# Altium project Gastroscopy-Controller.PrjPcb (part 1 of 2)
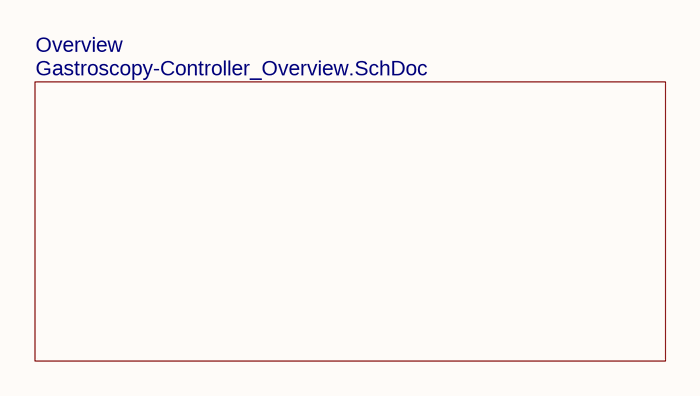
[diagram p0: Gastroscopy-Controller_Title.SchDoc]
GlobalAddress1: nab. reki Karpovki, d. 5/3E; GlobalAddress2: Saint-Petersburg, 197022; GlobalAddress3: Ph: +7 (911) 701-51-99; GlobalCompanyName: MRobot, LCC; GlobalDocumentNumberDrawingASM: 0000-0000; GlobalDocumentNumberDrawingPCB: 0000-0000; GlobalDocumentNumberPCB: 0000-0000; GlobalDocumentNumberSCH: 0000-0000; GlobalDocumentSubtitle: Gastroscopy Controller; GlobalDocumentTitle: Gastroscopy Controller; GlobalEngineer: Podlesnyi Vasilii; GlobalJiraKey: GSTRCNTRL; GlobalProjectTitle: Gastroscopy Controller; GlobalRevisionBOM: 0.1.0; GlobalRevisionPCB: 0.1.0; GlobalRevisionSCH: 0.1.0
7 sheets, 141 parts. Net scope: hierarchical (ports join the sheet entries above them; power ports are global).
Board file: Gastroscopy-Controller.PcbDoc
Sheets:
  Gastroscopy-Controller_Title.SchDoc
    Overview = Gastroscopy-Controller_Overview.SchDoc
      MCU = Gastroscopy-Controller_MCU.SchDoc
      USB = Gastroscopy-Controller_USB.SchDoc
      Buttons1 = Gastroscopy-Controller_Button.SchDoc
      Buttons2 = Gastroscopy-Controller_Button.SchDoc
      Buttons3 = Gastroscopy-Controller_Button.SchDoc
      Buttons4 = Gastroscopy-Controller_Button.SchDoc
      Buttons5 = Gastroscopy-Controller_Button.SchDoc
      Buttons6 = Gastroscopy-Controller_Button.SchDoc
      Relays1 = Gastroscopy-Controller_Relay.SchDoc
      Relays2 = Gastroscopy-Controller_Relay.SchDoc
      LED Driver = Gastroscopy-Controller_LED.SchDoc

## Sheet Gastroscopy-Controller_Title.SchDoc: not used
size 215 x 279 mm; PageSetup: Record=PageOptions|CenterHorizontal=True|CenterVertical=True|PrintScale=0.94|XCorrection=1.00|YCorrection=1.00|PrintKind=0|BorderSize=5000000|LeftOffset=0|BottomOffset=0|Orientation=2|PaperLength=1000|PaperWidth=1000|Scale=100|PaperSource=15|PrintQuality=600|MediaType=1|DitherType=10|PrintScaleMode=1|PaperKind=Letter|PaperIndex=1; VersionControl_RevNumber: not used; IsUserConfigurable: not used; Date: not used; ApprovedBy: not used; CheckedBy: not used; Author: not used; CompanyName: MRobot, LCC; DrawnBy: not used; Engineer: not used; Organization: not used; Address1: not used; Address2: not used; Address3: not used; Address4: not used; DocumentNumber: 0000-0000; Revision: not used; SheetNumber: 1; SheetTotal: 9; DocumentTitle: Gastroscopy Controller; DocumentSubtitle: Gastroscopy Controller; ProjectTitle: Gastroscopy Controller; JiraKey: GSTRCNTRL; Time: not used; ImagePath: not used; Application_BuildNumber: not used

### Sub-sheets
Overview = Gastroscopy-Controller_Overview.SchDoc: no entries

### Notes on the sheet
- Company:
- Project:
- Jira Key:

## Sheet Gastroscopy-Controller_Overview.SchDoc: Overview
size 279 x 215 mm; Date: not used; ApprovedBy: not used; CheckedBy: not used; Author: not used; CompanyName: MRobot, LCC; DrawnBy: not used; Engineer: Podlesnyi Vasilii; Organization: not used; Address1: nab. reki Karpovki, d. 5/3E; Address2: Saint-Petersburg, 197022; Address3: Ph: +7 (911) 701-51-99; Address4: not used; DocumentNumber: 0000-0000; Revision: 0.1.0; SheetNumber: 2; SheetTotal: 8; ProjectTitle: Gastroscopy Controller; Time: not used; ImagePath: not used; Application_BuildNumber: not used
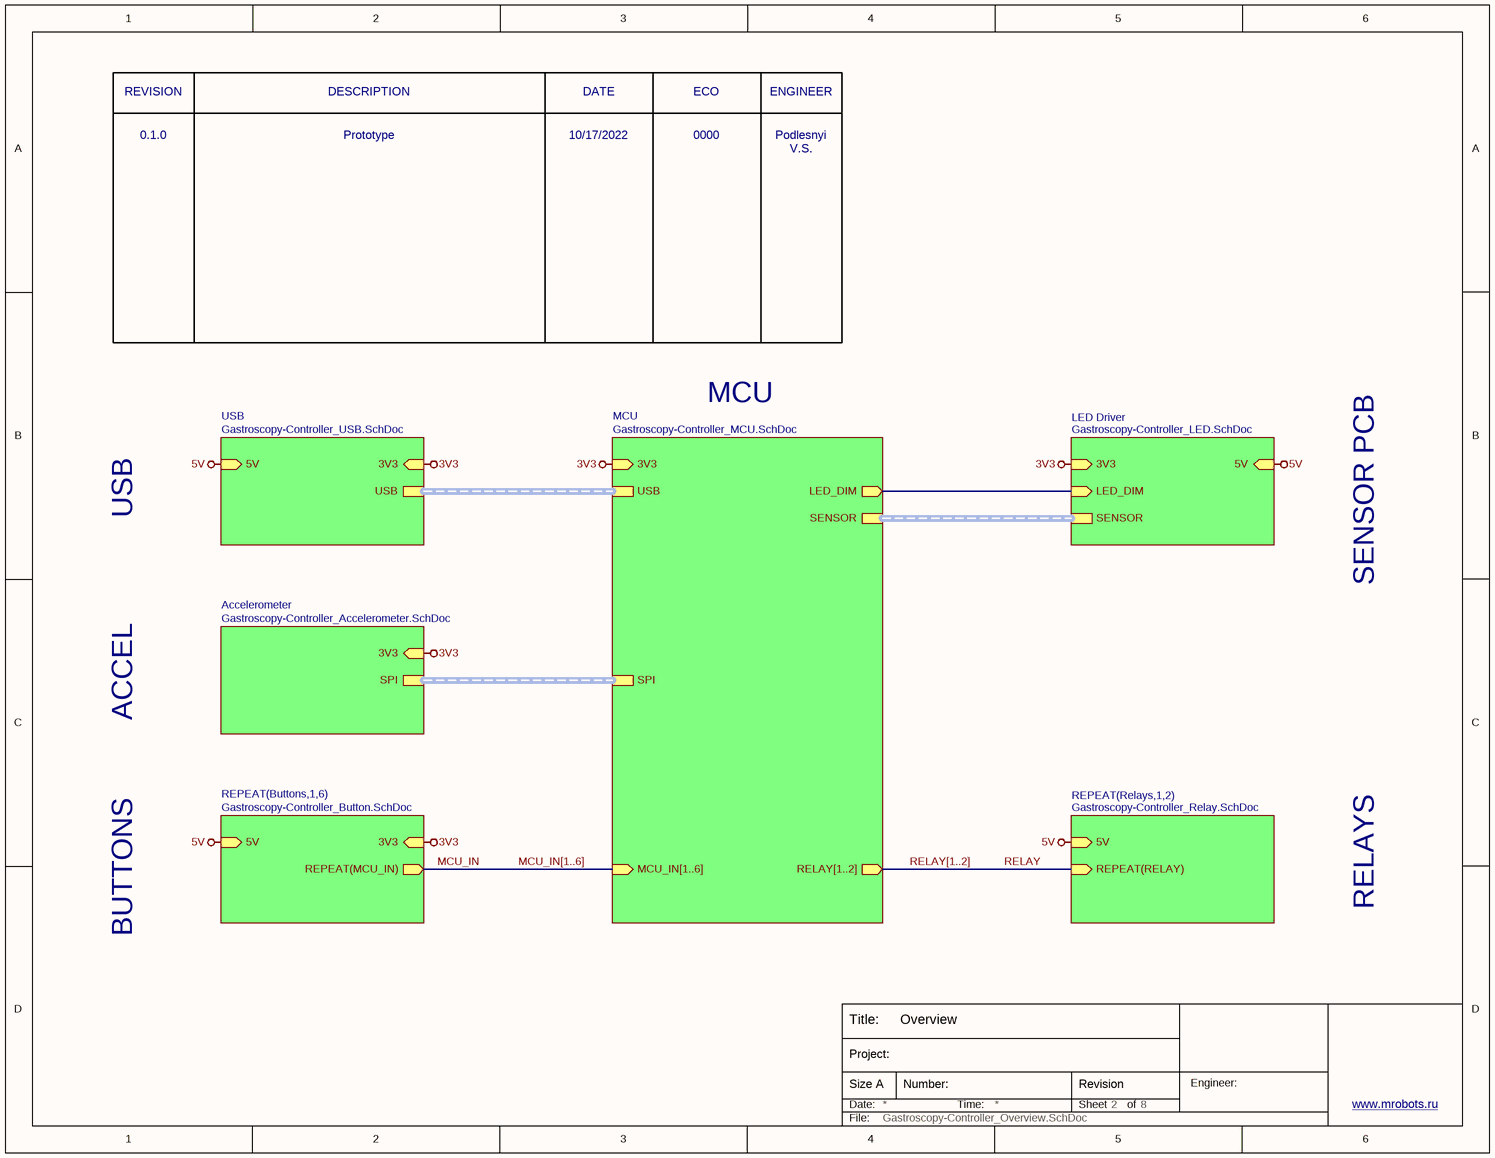
[diagram p1: Gastroscopy-Controller_Overview.SchDoc]

### Sub-sheets
Accelerometer = Gastroscopy-Controller_Accelerometer.SchDoc (file not in this document): 3V3 (in), SPI (harness SPI)
LED Driver = Gastroscopy-Controller_LED.SchDoc: 5V (in), LED_DIM (in), SENSOR (harness SENSOR), 3V3 (in)
MCU = Gastroscopy-Controller_MCU.SchDoc: 3V3 (in), SPI (harness SPI), USB (harness USB), MCU_IN[1..6] (in), RELAY[1..2] (out), SENSOR (harness SENSOR), LED_DIM (out)
REPEAT(Buttons,1,6) = Gastroscopy-Controller_Button.SchDoc: 3V3 (in), 5V (in), REPEAT(MCU_IN) (out)
REPEAT(Relays,1,2) = Gastroscopy-Controller_Relay.SchDoc: 5V (in), REPEAT(RELAY) (in)
USB = Gastroscopy-Controller_USB.SchDoc: 3V3 (in), USB (harness USB), 5V (in)

### Nets
3V3: sheet MCU/3V3, sheet USB/3V3, sheet Accelerometer/3V3, sheet REPEAT(Buttons,1,6)/3V3, sheet LED Driver/3V3
5V: sheet USB/5V, sheet REPEAT(Buttons,1,6)/5V, sheet REPEAT(Relays,1,2)/5V, sheet LED Driver/5V
LED_DIM: sheet MCU/LED_DIM, sheet LED Driver/LED_DIM
MCU_IN: sheet REPEAT(Buttons,1,6)/REPEAT(MCU_IN)
RELAY: sheet REPEAT(Relays,1,2)/REPEAT(RELAY)

### Buses and harness runs
bus MCU_IN[1..6] = sheet MCU/MCU_IN[1..6]
bus RELAY[1..2] = sheet MCU/RELAY[1..2]
harness sheet Accelerometer/SPI = sheet MCU/SPI
harness sheet LED Driver/SENSOR = sheet MCU/SENSOR
harness sheet MCU/USB = sheet USB/USB

### Notes on the sheet
- REVISION
- DESCRIPTION
- DATE
- ECO
- ENGINEER
- 0.1.0
- Prototype
- 10/17/2022
- 0000
- Podlesnyi V.S.
- MCU
- USB
- SENSOR PCB
- ACCEL
- RELAYS
- BUTTONS
- Title:
- Date:
- Size A
- Project:
- Number:
- Time:
- Sheet
- Revision
- of
- Engineer:
- www.mrobots.ru <http://mrobots.ru/>
- File:

## Sheet Gastroscopy-Controller_MCU.SchDoc: MCU
size 279 x 215 mm; Date: not used; ApprovedBy: not used; CheckedBy: not used; Author: not used; CompanyName: MRobot, LCC; DrawnBy: not used; Engineer: Podlesnyi Vasilii; Organization: not used; Address1: nab. reki Karpovki, d. 5/3E; Address2: Saint-Petersburg, 197022; Address3: Ph: +7 (911) 701-51-99; Address4: not used; DocumentNumber: 0000-0000; Revision: 0.1.0; SheetNumber: 4; SheetTotal: 8; ProjectTitle: Gastroscopy Controller; Time: not used; ImagePath: not used; Application_BuildNumber: not used
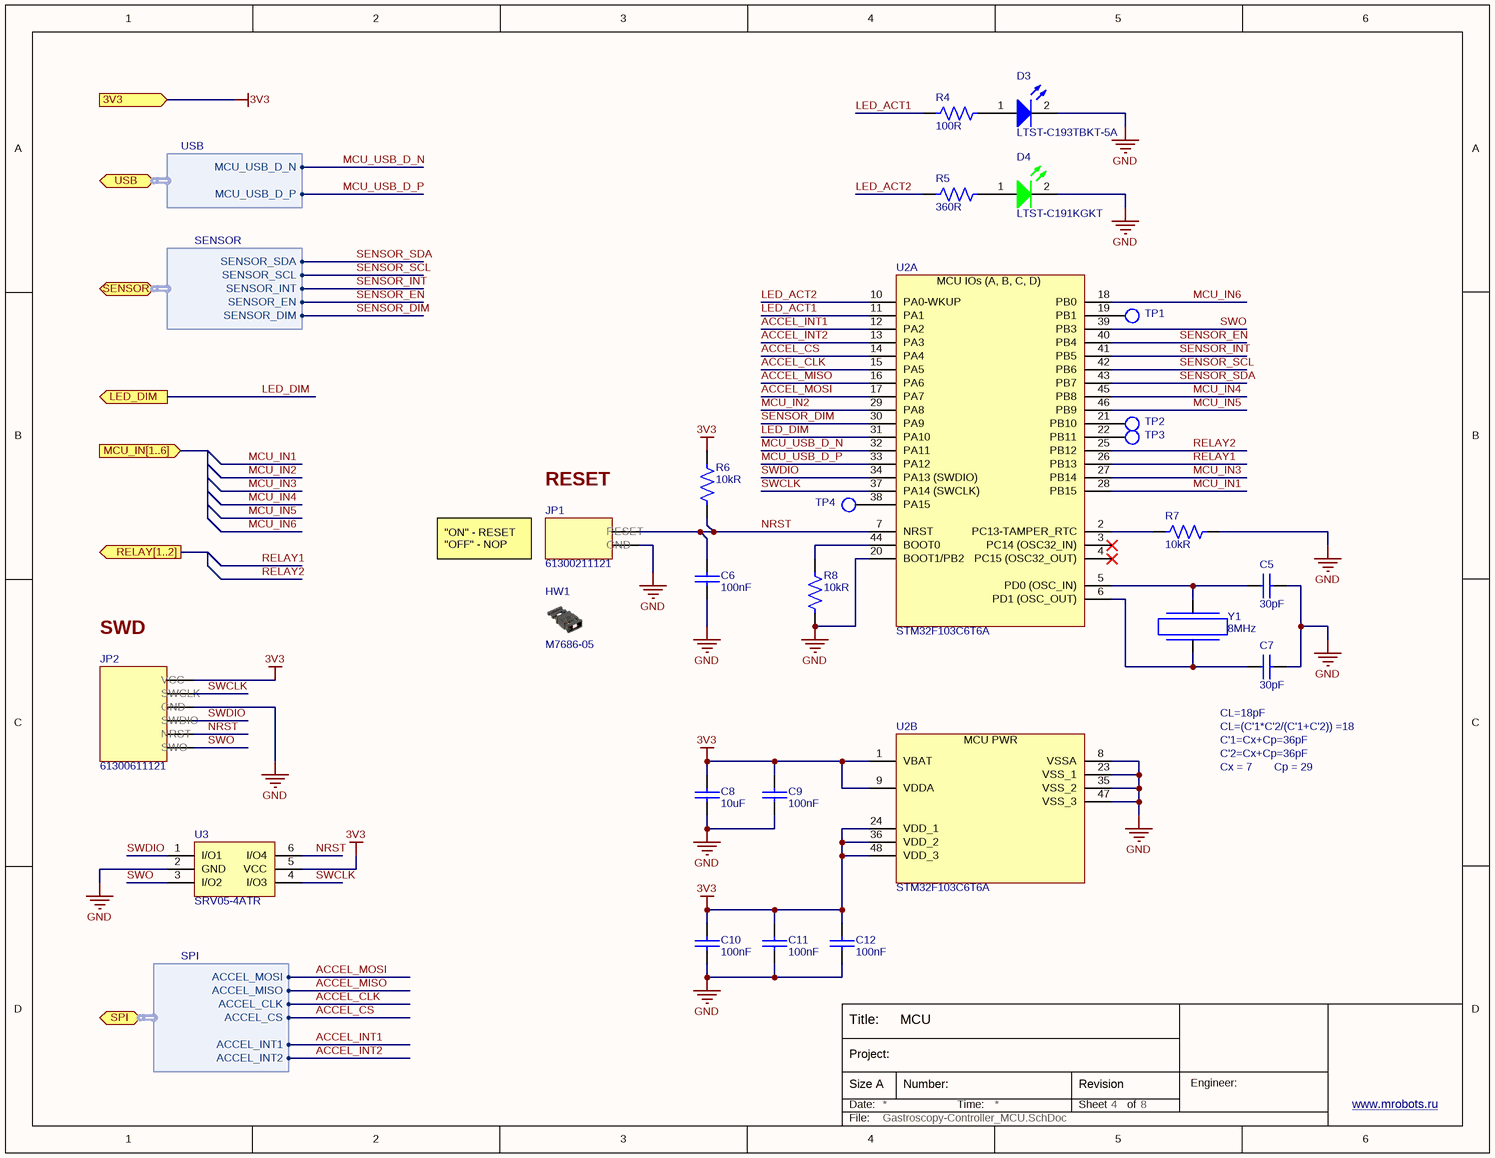
[diagram p2: Gastroscopy-Controller_MCU.SchDoc]

### Parts
C5  30pF  [CAP_0603]
C6  100nF  [CAP_0603]
C7  30pF  [CAP_0603]
C8  10uF  [CAP_0805]
C9  100nF  [CAP_0603]
C10  100nF  [CAP_0603]
C11  100nF  [CAP_0603]
C12  100nF  [CAP_0603]
D3  LTST-C193TBKT-5A  [L_0603_BLUE]
D4  LTST-C191KGKT  [L_0603_GREEN]
HW1  M7686-05  (mechanical)
JP1  61300211121  [PLS-2]
JP2  61300611121  [PLS-6]
R4  100R  [RES_0603]
R5  360R  [RES_0603]
R6  10kR  [RES_0603]
R7  10kR  [RES_0603]
R8  10kR  [RES_0603]
TP1  TEST_POINT_SMT  [TEST_POINT_SMT]  (value not drawn)  (no BOM)
TP2  TEST_POINT_SMT  [TEST_POINT_SMT]  (value not drawn)  (no BOM)
TP3  TEST_POINT_SMT  [TEST_POINT_SMT]  (value not drawn)  (no BOM)
TP4  TEST_POINT_SMT  [TEST_POINT_SMT]  (value not drawn)  (no BOM)
U2  STM32F103C6T6A  [LQFP48]  (parts A,B of 2)
U3  SRV05-4ATR  [SOT-23-6]
Y1  8MHz  [HC-49/US]

### Ports
3V3 (in), LED_DIM (out), MCU_IN[1..6] (in), RELAY[1..2] (out), SENSOR (bidir, harness SENSOR), SPI (bidir, harness SPI), USB (bidir, harness USB)

### Harnesses
USB: MCU_USB_D_N, MCU_USB_D_P
SENSOR: SENSOR_SDA, SENSOR_SCL, SENSOR_INT, SENSOR_EN, SENSOR_DIM
SPI: ACCEL_MOSI, ACCEL_MISO, ACCEL_CLK, ACCEL_INT1, ACCEL_CS, ACCEL_INT2

### Nets
3V3: C8.2 C9.1 C10.1 C11.1 C12.1 JP2.1 R6.1 U2.1(VBAT) U2.9(VDDA) U2.24(VDD_1) U2.36(VDD_2) U2.48(VDD_3) U3.5(VCC) ; port 3V3
GND: C5.2 C6.2 C7.2 C8.1 C9.2 C10.2 C11.2 C12.2 D3.2(K) D4.2(K) JP1.2 JP2.3 R7.1 R8.1 U2.8(VSSA) U2.20(BOOT1/PB2) U2.23(VSS_1) U2.35(VSS_2) U2.47(VSS_3) U3.2(GND)
ACCEL_CLK: U2.15(PA5) ; port SPI.ACCEL_CLK
ACCEL_CS: U2.14(PA4) ; port SPI.ACCEL_CS
ACCEL_INT1: U2.12(PA2) ; port SPI.ACCEL_INT1
ACCEL_INT2: U2.13(PA3) ; port SPI.ACCEL_INT2
ACCEL_MISO: U2.16(PA6) ; port SPI.ACCEL_MISO
ACCEL_MOSI: U2.17(PA7) ; port SPI.ACCEL_MOSI
LED_ACT1: R4.1 U2.11(PA1)
LED_ACT2: R5.1 U2.10(PA0-WKUP)
LED_DIM: U2.31(PA10) ; port LED_DIM
MCU_IN1: U2.28(PB15)
MCU_IN2: U2.29(PA8)
MCU_IN3: U2.27(PB14)
MCU_IN4: U2.45(PB8)
MCU_IN5: U2.46(PB9)
MCU_IN6: U2.18(PB0)
MCU_USB_D_N: U2.32(PA11) ; port USB.MCU_USB_D_N
MCU_USB_D_P: U2.33(PA12) ; port USB.MCU_USB_D_P
NRST: C6.1 JP1.1 JP2.5 R6.2 U2.7(NRST) U3.6(I/O4)
RELAY1: U2.26(PB13)
RELAY2: U2.25(PB12)
SENSOR_DIM: U2.30(PA9) ; port SENSOR.SENSOR_DIM
SENSOR_EN: U2.40(PB4) ; port SENSOR.SENSOR_EN
SENSOR_INT: U2.41(PB5) ; port SENSOR.SENSOR_INT
SENSOR_SCL: U2.42(PB6) ; port SENSOR.SENSOR_SCL
SENSOR_SDA: U2.43(PB7) ; port SENSOR.SENSOR_SDA
SWCLK: JP2.2 U2.37(PA14_(SWCLK)) U3.4(I/O3)
SWDIO: JP2.4 U2.34(PA13_(SWDIO)) U3.1(I/O1)
SWO: JP2.6 U2.39(PB3) U3.3(I/O2)
NetC5_1: C5.1 U2.5(PD0_(OSC_IN)) Y1.2
NetC7_1: C7.1 U2.6(PD1_(OSC_OUT)) Y1.1
NetD3_1: D3.1(A) R4.2
NetD4_1: D4.1(A) R5.2
NetR7_2: R7.2 U2.2(PC13-TAMPER_RTC)
NetR8_2: R8.2 U2.44(BOOT0)
NetTP1_1: TP1.1 U2.19(PB1)
NetTP2_1: TP2.1 U2.21(PB10)
NetTP3_1: TP3.1 U2.22(PB11)
NetTP4_1: TP4.1 U2.38(PA15)

Not connected (* = marked no-connect by the designer): U2 3(PC14_(OSC32_IN))* 4(PC15_(OSC32_OUT))*

### Notes on the sheet
- (near JP1) RESET
- (near HW1) "ON" - RESET
  "OFF" - NOP
- SWD
- (near C7) CL=18pF
- CL=(C'1*C'2/(C'1+C'2)) =18
- Cx = 7
- C'1=Cx+Cp=36pF
- C'2=Cx+Cp=36pF
- Cp = 29
- Title:
- Date:
- Size A
- Project:
- Number:
- Time:
- Sheet
- Revision
- of
- Engineer:
- www.mrobots.ru <http://mrobots.ru/>
- File:
- (in symbol STM32F103C6T6A, part A) MCU IOs (A, B, C, D)
- (in symbol STM32F103C6T6A, part B) MCU PWR

### Library data of the parts
C5 C7 = CC0603JRNPO9BN300: CAP CER 30PF 50V NPO 0603; Manufacturer: Yageo; Tolerance: 5%; Dielectric: C0G; Dissipation Factor: 0.1%; Insulation Resistance: 10GR; Supplier 1: Arrow Electronics; Manufacturer Part Number: CC0603JRNPO9BN300; RoHS: Yes; Category: Ceramic Capacitors; Stock 1: 24000; Pricing 1: 4000=0,01130, 8000=0,00940, 12000=0,00820, 40000=0,00780 (USD); Mount: Surface Mount; Case/Package: 0603; Number of Pins: 2; Case Code (Imperial): 0603; Case Code (Metric): 1608; Weight: 7.1E-05oz; Min Operating Temperature: -55°C; Max Operating Temperature: 125°C; Capacitance: 30pF; Voltage Rating: 50V; Packaging: Tape and Reel; Voltage Rating (DC): 50V; Termination: SMD/SMT; Resistor Type: Ceramic; Series: CC; Construction: Flat; Length: 1.6mm; Width: 0.8mm; Height: 0.8mm; Thickness: 0.035inch; Depth: 0.8mm; Radiation Hardening: No; Reach SVHC Compliant: Yes; Lead Free: Lead Free; RoHS Compliant: Yes; ComponentLink1URL: https://datasheet.ciiva.com/26862/getdatasheetpartid-403531-26862766.pdf?src-supplier=Verical; ComponentLink1Description: https://datasheet.ciiva.com/26862/getdatasheetpartid-403531-26862766.pdf?src-supplier=Verical; ComponentLink2URL: https://datasheet.ciiva.com/7978/1132289-7978140.pdf?src-supplier=Element14; ComponentLink2Description: https://datasheet.ciiva.com/7978/1132289-7978140.pdf?src-supplier=Element14; ComponentLink3URL: https://datasheet.ciiva.com/28450/1443161-28450494.pdf?src-supplier=Element14; ComponentLink3Description: https://datasheet.ciiva.com/28450/1443161-28450494.pdf?src-supplier=Element14; ComponentLink4URL: https://datasheet.ciiva.com/13264/upy-gp-np0-16v-to-50v-8-3714-13264406.pdf?src-supplier=Mouser; ComponentLink4Description: https://datasheet.ciiva.com/13264/upy-gp-np0-16v-to-50v-8-3714-13264406.pdf?src-supplier=Mouser; Supplier Part Number 1: CC0603JRNPO9BN300
C6 C9-C12 = CL10B104KB8NNNL: CAP CER 0.1UF 50V X7R 0603; Manufacturer 1: Samsung; Tolerance: 10%; Supplier 1: Digi-Key; Manufacturer Part Number 1: CL10B104KB8NNNL; RoHS: Yes; Category: Ceramic Capacitors; Stock 1: 2348404; Pricing 1: 15000=0,00532, 30000=0,00506 (USD); Mount: Surface Mount; Case/Package: 0603; Min Operating Temperature: -55°C; Max Operating Temperature: 125°C; Capacitance: 100nF; Packaging: Tape and Reel; Package Quantity: 15000; Voltage Rating: 50V; Dielectric: X7R; Voltage Rating (DC): 50V; Series: CL; Construction: Flat; Length: 1.6mm; Width: 0.031inch; Height: 0.8mm; Thickness: 0.035inch; Depth: 0.8mm; Radiation Hardening: No; RoHS Compliant: Yes; ComponentLink1URL: https://datasheet.ciiva.com/26838/getdatasheetpartid-357523-26838415.pdf?src-supplier=Verical; ComponentLink1Description: https://datasheet.ciiva.com/26838/getdatasheetpartid-357523-26838415.pdf?src-supplier=Verical; ComponentLink2URL: https://datasheet.ciiva.com/25741/cl10b104kb8nnnl-25741341.pdf?src-supplier=Digi-Key; ComponentLink2Description: https://datasheet.ciiva.com/25741/cl10b104kb8nnnl-25741341.pdf?src-supplier=Digi-Key; Supplier Part Number 1: 1276-CL10B104KB8NNNLTR-ND
C8 = CL21B106KOQNNNE: CAP CER 10UF 16V X7R 0805; Manufacturer 1: Samsung; Tolerance: 10%; Supplier 1: Avnet; Manufacturer Part Number 1: CL21B106KOQNNNE; RoHS: Yes; Category: Ceramic Capacitors; Stock 1: 1089000; Pricing 1: 2000=0,02892, 4000=0,02851, 8000=0,02768, 12000=0,02707, 16000=0,02603 (USD); Mount: Surface Mount; Case/Package: 0805; Case Code (Metric): 2012; Case Code (Imperial): 0805; Contact Plating: Tin; Min Operating Temperature: -55°C; Max Operating Temperature: 125°C; Packaging: Tape and Reel; Capacitance: 10uF; Voltage Rating: 16V; Package Quantity: 1; Dielectric: X7R; Series: CL; Construction: Flat; Voltage: 16V; Length: 2mm; Width: 0.049inch; Height: 1.25mm; Thickness: 0.055inch; Depth: 1.25mm; Radiation Hardening: No; RoHS Compliant: Yes; ComponentLink1URL: https://datasheet.ciiva.com/25794/cl21b106koqnnne-25794472.pdf?src-supplier=Digi-Key; ComponentLink1Description: https://datasheet.ciiva.com/25794/cl21b106koqnnne-25794472.pdf?src-supplier=Digi-Key; ComponentLink2URL: https://datasheet.ciiva.com/16428/cl21b106koqnnne-16428887.pdf?src-supplier=Future+Electronics; ComponentLink2Description: https://datasheet.ciiva.com/16428/cl21b106koqnnne-16428887.pdf?src-supplier=Future+Electronics; ComponentLink3URL: https://datasheet.ciiva.com/26920/getdatasheetpartid-355170-26920201.pdf?src-supplier=Verical; ComponentLink3Description: https://datasheet.ciiva.com/26920/getdatasheetpartid-355170-26920201.pdf?src-supplier=Verical; Supplier Part Number 1: CL21B106KOQNNNE
D3 = LTST-C193TBKT-5A: LED BLUE CLEAR CHIP SMD; Manufacturer 1: Vishay Lite-On; Lens Color: Colorless; Forward Current: 20mA; Forward Voltage: 2.8V; Luminous Intensity: 15mcd; Viewing Angle: 130°; Lens Style: Diffused,Colorless,Rectangular,Clear; Dominant Wavelength: 475nm; Test Current: 5mA; Number of Elements: 1; Power Dissipation: 76mW; Reverse Voltage: 5V; Supplier 1: Arrow Electronics; RoHS: Yes; Category: LEDs; Stock 1: 226; Pricing 1: 1=0.33280, 10=0.16780, 25=0.16610 (USD); Mount: Surface Mount; Case/Package: 0603; Number of Pins: 2; Color: Blue; Case Code (Metric): 1608; Case Code (Imperial): 0603; Min Operating Temperature: -20°C; Max Operating Temperature: 80°C; Illumination Color: Blue; Packaging: Tape and Reel; Package Quantity: 1; Lens Transparency: Clear; Number of LEDs: 1; Length: 1.6mm; Width: 0.8mm; Height: 0.35mm; Depth: 0.8mm; Radiation Hardening: No; RoHS Compliant: Yes; Lead Free: Lead Free; ComponentLink1URL: https://datasheet.ciiva.com/2111/ltst-c193tbkt-5a-2111219.pdf?src-supplier=Digi-Key; ComponentLink1Description: https://datasheet.ciiva.com/2111/ltst-c193tbkt-5a-2111219.pdf?src-supplier=Digi-Key; ComponentLink2URL: https://datasheet.ciiva.com/11773/0900766b80dc0554-11773880.pdf?src-supplier=RSComponents; ComponentLink2Description: https://datasheet.ciiva.com/11773/0900766b80dc0554-11773880.pdf?src-supplier=RSComponents; ComponentLink3URL: https://datasheet.ciiva.com/4688/lite-on-ltst-c193tbkt-5a-187386-4688832.pdf?src-supplier=Mouser; ComponentLink3Description: https://datasheet.ciiva.com/4688/lite-on-ltst-c193tbkt-5a-187386-4688832.pdf?src-supplier=Mouser; ComponentLink4URL: https://datasheet.ciiva.com/16210/ltst-c193tbkt-5a-16210824.pdf?src-supplier=Future+Electronics; ComponentLink4Description: https://datasheet.ciiva.com/16210/ltst-c193tbkt-5a-16210824.pdf?src-supplier=Future+Electronics; ComponentLink5URL: https://datasheet.ciiva.com/15201/getdatasheetpartid-293056-15201395.pdf?src-supplier=Verical; ComponentLink5Description: https://datasheet.ciiva.com/15201/getdatasheetpartid-293056-15201395.pdf?src-supplier=Verical; ComponentLink6URL: https://datasheet.ciiva.com/2111/p-100-ltst-c193tbkt-5a-2111220.pdf?src-supplier=Digi-Key; ComponentLink6Description: https://datasheet.ciiva.com/2111/p-100-ltst-c193tbkt-5a-2111220.pdf?src-supplier=Digi-Key; ComponentLink7URL: https://datasheet.ciiva.com/2111/p-100-ltst-c193tbkt-5a-2111221.pdf?src-supplier=Digi-Key; ComponentLink7Description: https://datasheet.ciiva.com/2111/p-100-ltst-c193tbkt-5a-2111221.pdf?src-supplier=Digi-Key; Supplier Part Number 1: LTST-C193TBKT-5A; Manufacturer Part Number 1: LTST-C193TBKT-5A
D4 = LTST-C191KGKT: LED GREEN CLEAR SMD; Manufacturer 1: Vishay Lite-On; Lens Color: Colorless; Luminous Intensity: 35mcd; Viewing Angle: 130°; Forward Voltage: 2V; Dominant Wavelength: 571nm; Test Current: 20mA; Wavelength: 574nm; Lens Style: Rectangular,Colorless; Forward Current: 30mA; Number of Elements: 1; Power Dissipation: 75mW; Reverse Voltage: 5V; Supplier 1: Arrow Electronics; RoHS: Yes; Category: LEDs; Stock 1: 10000; Pricing 1: 5000=0.04240, 10000=0.03360, 25000=0.02880, 50000=0.02750 (USD); Mount: Surface Mount; Case/Package: 0603; Number of Pins: 2; Color: Green; Case Code (Metric): 1608; Case Code (Imperial): 0603; Min Operating Temperature: -55°C; Max Operating Temperature: 85°C; Packaging: Tape and Reel; Package Quantity: 1; Lens Transparency: Clear; Illumination Color: Green; Number of LEDs: 1; Power Rating: 75mW; Max Power Dissipation: 75mW; Length: 1.6mm; Width: 0.8mm; Height: 0.55mm; Depth: 0.8mm; Radiation Hardening: No; RoHS Compliant: Yes; Lead Free: Lead Free; ComponentLink1URL: https://datasheet.ciiva.com/2109/ltst-c191kgkt-2109973.pdf?src-supplier=Digi-Key; ComponentLink1Description: https://datasheet.ciiva.com/2109/ltst-c191kgkt-2109973.pdf?src-supplier=Digi-Key; Supplier Part Number 1: LTST-C191KGKT; Manufacturer Part Number 1: LTST-C191KGKT
HW1 = M7686-05: CLOSED TOP JUMPER SOCKET; Manufacturer 1: Harwin; Plating: Gold; Number of Contacts: 2; Contact Resistance: 25mR; Current Rating: 3A; Mating Cycles: 300; Voltage Rating (AC): 250V; Gender: Receptacle; Insulation Resistance: 1GR; Pitch: 2.54mm; Body Length: 10mm; Supplier 1: Digi-Key; Manufacturer Part Number 1: M7686-05; RoHS: Yes; Category: Terminal Blocks; Stock 1: 26597; Pricing 1: 1=0,40000, 10=0,34400, 25=0,30280, 50=0,27820, 100=0,26720, 250=0,23996, 500=0,22906, 1000=0,19089, 2500=0,17453 (USD); Housing Color: Black; Contact Material: Bronze; Contact Plating: Gold; Color: Black; Material: Polyester; Weight: 0.0625lb; Housing Material: Polyester; Min Operating Temperature: -40°C; Max Operating Temperature: 85°C; Number of Rows: 1; Voltage Rating (DC): 250V; Contact Gender: Female; Package Quantity: 2500; Voltage Rating: 250V; Max Current Rating: 3A; Number of Positions: 2; Packaging: Bulk; Max Voltage Rating (AC): 250V; Orientation: Straight; Series: M76; Length: 10mm; Width: 5mm; Height: 0.394inch; Lead Pitch: 2.54mm; Depth: 2.4mm; Radiation Hardening: No; REACH SVHC: No SVHC; Flammability Rating: UL94 V-0; RoHS Compliant: Yes; ComponentLink1URL: https://datasheet.ciiva.com/11754/0900766b81034e4c-11754957.pdf?src-supplier=RSComponents; ComponentLink1Description: https://datasheet.ciiva.com/11754/0900766b81034e4c-11754957.pdf?src-supplier=RSComponents; ComponentLink2URL: https://datasheet.ciiva.com/6781/m7684-m7687-6781583.pdf?src-supplier=Digi-Key; ComponentLink2Description: https://datasheet.ciiva.com/6781/m7684-m7687-6781583.pdf?src-supplier=Digi-Key; Supplier Part Number 1: 952-2023-ND
JP1 = 61300211121: CONN HEADER VERT 2POS 2.54MM; Manufacturer 1: Wurth Electronics; Current Rating: 3A; Voltage Rating: 250V; Number of Positions: 2; Gender: Male; Connector Type: Male Pin; Pitch: 0.1inch; Contact_1: RESET; Contact_2: GND; Supplier 1: Digi-Key; RoHS: Yes; Category: Headers and Wire Housings; Pricing 1: 1=0.13000, 10=0.11000, 25=0.09120, 50=0.07700, 100=0.06900, 1000=0.06300 (USD); Mount: Through Hole; Contact Plating: Gold; Housing Material: PBT; Contact Material: Copper Alloy,Copper; Color: Black; Min Operating Temperature: -40°C; Max Operating Temperature: 125°C; Number of Rows: 1; Contact Gender: Male; Packaging: Bulk; Termination: Through Hole; Number of Contacts: 2; Series: WR-PHD; Contact Type: Male Pin; Contact Mating Length: 0.236inch; REACH SVHC: Unknown; Lead Free: Lead Free; RoHS Compliant: Yes; ComponentLink1URL: https://datasheet.ciiva.com/13619/6130xx11121-48870-13619345.pdf?src-supplier=Mouser; ComponentLink1Description: https://datasheet.ciiva.com/13619/6130xx11121-48870-13619345.pdf?src-supplier=Mouser; Supplier Part Number 1: 732-5315-ND; Manufacturer Part Number 1: 61300211121
JP2 = 61300611121: CONN HEADER VERT 6POS 2.54MM; Manufacturer 1: Wurth Electronics; Current Rating: 3A; Voltage Rating: 250V; Number of Positions: 6; Gender: Male; Connector Type: Male Pin; Pitch: 0.1inch; Contact_1: VCC; Contact_2: SWCLK; Contact_3: GND; Contact_4: SWDIO; Contact_5: NRST; Contact_6: SWO; Supplier 1: Digi-Key; RoHS: Yes; Category: Headers and Wire Housings; Stock 1: 8041; Pricing 1: 1=0.34000, 10=0.28900, 25=0.24000, 50=0.20100, 100=0.18200, 1000=0.16600 (USD); Mount: Through Hole; Contact Plating: Gold; Contact Material: Copper Alloy,Copper; Housing Material: PBT; Color: Black; Min Operating Temperature: -40°C; Max Operating Temperature: 125°C; Number of Rows: 1; Contact Gender: Male; Packaging: Bulk; Termination: Through Hole; Number of Contacts: 6; Series: WR-PHD; Contact Type: Male Pin; Contact Mating Length: 0.236inch; REACH SVHC: Unknown; Lead Free: Lead Free; RoHS Compliant: Yes; ComponentLink1URL: http://www.mouser.com/ds/2/445/6130xx11121-538006.pdf?src-supplier=Mouser; ComponentLink1Description: http://www.mouser.com/ds/2/445/6130xx11121-538006.pdf?src-supplier=Mouser; ComponentLink2URL: http://www.farnell.com/cad/1737268.pdf?src-supplier=Element14; ComponentLink2Description: http://www.farnell.com/cad/1737268.pdf?src-supplier=Element14; ComponentLink3URL: https://katalog.we-online.de/em/datasheet/6130xx11121.pdf?src-supplier=Digi-Key; ComponentLink3Description: https://katalog.we-online.de/em/datasheet/6130xx11121.pdf?src-supplier=Digi-Key; Supplier Part Number 1: 732-5319-ND; Manufacturer Part Number 1: 61300611121
R4 = RC0603FR-07100RL: RES 100 OHM 1% 1/10W 0603; Manufacturer 1: Yageo; Voltage Rating (DC): 50V; Temperature Coefficient: 100ppm/°C; Power Rating: 100mW; Supplier 1: Arrow Electronics; RoHS: Yes; Category: Chip SMD Resistors; Stock 1: 17580000; Pricing 1: 5000=0,00180 (USD); Case/Package: 0603; Number of Pins: 2; Case Code (Imperial): 0603; Case Code (Metric): 1608; Size Code: 0603; Min Operating Temperature: -55°C; Max Operating Temperature: 155°C; Resistance: 100R; Tolerance: 1%; Packaging: Tape and Reel; Resistor Type: Thick Film; Voltage Rating: 50V; Termination: SMD/SMT; Features: Moisture Resistant; Series: RC; Max Power Dissipation: 100mW; Number of Terminations: 2; Construction: Rectangular; Resistance Tolerance: 1%; Technology: THICK FILM; Length: 1.6mm; Width: 0.8mm; Height: 0.45mm; Depth: 0.8mm; REACH SVHC: Unknown; Lead Free: Lead Free; Military Standard: Not; RoHS Compliant: Yes; Supplier Part Number 1: RC0603FR-07100RL; Manufacturer Part Number 1: RC0603FR-07100RL
R5 = RC0603FR-07360RL: RES 360 OHM 1% 1/10W 0603; Manufacturer 1: Yageo; Power Rating: 100mW; Voltage Rating: 50V; Temperature Coefficient: 100ppm/°C; Supplier 1: Arrow Electronics; Manufacturer Part Number 1: RC0603FR-07360RL; RoHS: Yes; Category: Chip SMD Resistors; Stock 1: 7884; Pricing 1: 1=0,05320, 10=0,01120, 100=0,00760, 250=0,00660, 1000=0,00380, 3000=0,00370, 6000=0,00230 (USD); Case/Package: 0603; Case Code (Metric): 1608; Case Code (Imperial): 0603; Size Code: 0603; Min Operating Temperature: -55°C; Max Operating Temperature: 155°C; Packaging: Tape and Reel; Resistance: 360R; Tolerance: 1%; Package Quantity: 1; Resistor Type: Thick Film; Number of Terminations: 2; Termination: SMD/SMT; Max Power Dissipation: 100mW; Voltage Rating (DC): 50V; Features: Moisture Resistant; Series: RC; Construction: Rectangular; Length: 1.6mm; Width: 0.031inch; Height: 0.022inch; Depth: 0.8mm; Military Standard: Not; Lead Free: Lead Free; RoHS Compliant: Yes; ComponentLink1URL: https://datasheet.ciiva.com/2454/pyu-r-int-thick-7-2454271.pdf?src-supplier=Digi-Key; ComponentLink1Description: https://datasheet.ciiva.com/2454/pyu-r-int-thick-7-2454271.pdf?src-supplier=Digi-Key; ComponentLink2URL: https://datasheet.ciiva.com/2454/pyu-r-int-thick-7-2454272.pdf?src-supplier=Digi-Key; ComponentLink2Description: https://datasheet.ciiva.com/2454/pyu-r-int-thick-7-2454272.pdf?src-supplier=Digi-Key; ComponentLink3URL: https://datasheet.ciiva.com/2454/pyu-r-int-thick-7-2454270.pdf?src-supplier=Digi-Key; ComponentLink3Description: https://datasheet.ciiva.com/2454/pyu-r-int-thick-7-2454270.pdf?src-supplier=Digi-Key; ComponentLink4URL: https://datasheet.ciiva.com/12558/rc0603-272842-12558645.pdf?src-supplier=Mouser; ComponentLink4Description: https://datasheet.ciiva.com/12558/rc0603-272842-12558645.pdf?src-supplier=Mouser; Supplier Part Number 1: RC0603FR-07360RL
R6-R8 = RC0603FR-0710KL: RES 10K OHM 1% 1/10W 0603; Manufacturer 1: Yageo; Voltage Rating (DC): 50V; Temperature Coefficient: 100ppm/°C; Power Rating: 100mW; Voltage Rating: 75V; Supplier 1: Arrow Electronics; RoHS: Yes; Category: Chip SMD Resistors; Stock 1: 4950000; Pricing 1: 5000=0,00240 (USD); Case/Package: 0603; Number of Pins: 2; Case Code (Imperial): 0603; Case Code (Metric): 1608; Weight: 7.1E-05oz; Size Code: 0603; Min Operating Temperature: -55°C; Max Operating Temperature: 155°C; Packaging: Tape and Reel; Resistance: 10kR; Tolerance: 1%; Resistor Type: Thick Film; Termination: SMD/SMT; Features: Moisture Resistant; Series: RC; Max Power Dissipation: 100mW; Number of Terminations: 2; Resistance Tolerance: 1%; Construction: Rectangular; Length: 1.6mm; Width: 0.8mm; Height: 0.45mm; Depth: 0.8mm; Lead Pitch: 0.3mm; REACH SVHC: Unknown; Lead Free: Lead Free; Military Standard: Not; RoHS Compliant: Yes; ComponentLink1URL: https://datasheet.ciiva.com/7660/38590-7660789.pdf?src-supplier=Element14; ComponentLink1Description: https://datasheet.ciiva.com/7660/38590-7660789.pdf?src-supplier=Element14; ComponentLink2URL: https://datasheet.ciiva.com/7983/443971-7983596.pdf?src-supplier=Element14; ComponentLink2Description: https://datasheet.ciiva.com/7983/443971-7983596.pdf?src-supplier=Element14; ComponentLink3URL: https://datasheet.ciiva.com/22747/443971-22747519.pdf?src-supplier=Element14; ComponentLink3Description: https://datasheet.ciiva.com/22747/443971-22747519.pdf?src-supplier=Element14; ComponentLink4URL: https://datasheet.ciiva.com/46440/1868787-46440891.pdf?src-supplier=Element14; ComponentLink4Description: https://datasheet.ciiva.com/46440/1868787-46440891.pdf?src-supplier=Element14; ComponentLink5URL: https://datasheet.ciiva.com/7746/1738695-7746239.pdf?src-supplier=Element14; ComponentLink5Description: https://datasheet.ciiva.com/7746/1738695-7746239.pdf?src-supplier=Element14; Supplier Part Number 1: RC0603FR-0710KL; Manufacturer Part Number 1: RC0603FR-0710KL
TP1-TP4 = TEST_POINT_SMT: STM TEST POINT
U2 = STM32F103C6T6A: IC MCU 32BIT 32KB FLASH 48LQFP; Manufacturer 1: STMicroelectronics; Number of Timers/Counters: 3; Max Supply Voltage: 3.6V; Frequency: 72MHz; Interface: I2C,SPI,USART; RAM Size: 10KB; Max Power Dissipation: 363mW; Number of I/Os: 37; Min Supply Voltage: 2V; Oscillator Type: Internal; Data Bus Width: 32b; Watchdog Timer: Yes; Peripherals: POR,PWM,WDT,DMA,Temp Sensor,I2C; Core Architecture: ARM; Number of ADC Channels: 10; Number of SPI Channels: 1; Supplier 1: Newark; RoHS: Yes; Category: Microcontrollers; Pricing 1: 1=6,56000, 10=5,90000, 1500=5,90000 (USD); Case/Package: LQFP; Number of Pins: 48; Weight: 0.006409oz; Min Operating Temperature: -40°C; Max Operating Temperature: 85°C; Package Quantity: 1500; Packaging: Tray; Max Frequency: 72MHz; Number of Programmable I/O: 37; Memory Type: FLASH; Memory Size: 32KB; Series: STM32F103C6; Number of I2C Channels: 1; Address Bus Width: 32b; Length: 7mm; Width: 7mm; Height: 1.4mm; Radiation Hardening: No; Lead Free: Lead Free; REACH SVHC: No SVHC; RoHS Compliant: Yes; ComponentLink1URL: https://datasheet.ciiva.com/15122/getdatasheetpartid-69879-15122075.pdf?src-supplier=Verical; ComponentLink1Description: https://datasheet.ciiva.com/15122/getdatasheetpartid-69879-15122075.pdf?src-supplier=Verical; ComponentLink2URL: https://datasheet.ciiva.com/14100/pustm-arm-microcont-stm32f103-en-14100507.pdf?src-supplier=Distrelec; ComponentLink2Description: https://datasheet.ciiva.com/14100/pustm-arm-microcont-stm32f103-en-14100507.pdf?src-supplier=Distrelec; Supplier Part Number 1: 57P1219; Manufacturer Part Number 1: STM32F103C6T6A
U3 = SRV05-4ATR: TVS DIODE 5VWM 17.5VC SOT23-6; Manufacturer 1: Sangdest Microelectronics; Supplier 1: Digi-Key; Manufacturer Part Number 1: SRV05-4ATR; RoHS: No; Category: TVS Diodes; Stock 1: 31500; Pricing 1: 1=0,45000, 10=0,36700, 100=0,24990, 500=0,18744, 1000=0,14058 (USD); Supplier Part Number 1: 1655-1653-1-ND
Y1 = ATS080B-E: CRYSTAL 8.0000MHZ 18PF TH; Manufacturer 1: CTS; Frequency Tolerance: 30ppm; ESR (Equivalent Series Resistance): 60R; Frequency Stability: 50ppm; Supplier 1: Avnet; RoHS: Yes; Category: Crystals; Stock 1: 4510; Pricing 1: 1000=0.18120, 1200=0.17880, 2200=0.17040, 5000=0.13800, 10000=0.12150, 50000=0.10956, 100000=0.10707 (USD); Mount: Through Hole; Number of Pins: 2; Contact Plating: Copper,Tin,Silver; Min Operating Temperature: -40°C; Max Operating Temperature: 85°C; Package Quantity: 100; Frequency: 8MHz; Load Capacitance: 18pF; Packaging: Bulk; Tolerance: 30ppm; Termination: Radial; Series: ATS; Length: 0.427inch; Width: 0.177inch; Height: 0.145inch; RoHS Compliant: Yes; ComponentLink1URL: https://datasheet.ciiva.com/859/008-0309-0-859649.pdf?src-supplier=Digi-Key; ComponentLink1Description: https://datasheet.ciiva.com/859/008-0309-0-859649.pdf?src-supplier=Digi-Key; ComponentLink2URL: https://datasheet.ciiva.com/3176/008-0309-0-3176342.pdf?src-supplier=Avnet; ComponentLink2Description: https://datasheet.ciiva.com/3176/008-0309-0-3176342.pdf?src-supplier=Avnet; ComponentLink3URL: https://datasheet.ciiva.com/4945/008-0309-0-32667-4945355.pdf?src-supplier=Mouser; ComponentLink3Description: https://datasheet.ciiva.com/4945/008-0309-0-32667-4945355.pdf?src-supplier=Mouser; Supplier Part Number 1: ATS080B-E; Manufacturer Part Number 1: ATS080B-E

## Sheet Gastroscopy-Controller_USB.SchDoc: USB
size 279 x 215 mm; Date: not used; ApprovedBy: not used; CheckedBy: not used; Author: not used; CompanyName: MRobot, LCC; DrawnBy: not used; Engineer: Podlesnyi Vasilii; Organization: not used; Address1: nab. reki Karpovki, d. 5/3E; Address2: Saint-Petersburg, 197022; Address3: Ph: +7 (911) 701-51-99; Address4: not used; DocumentNumber: 0000-0000; Revision: 0.1.0; SheetNumber: 3; SheetTotal: 8; ProjectTitle: Gastroscopy Controller; Time: not used; ImagePath: not used; Application_BuildNumber: not used
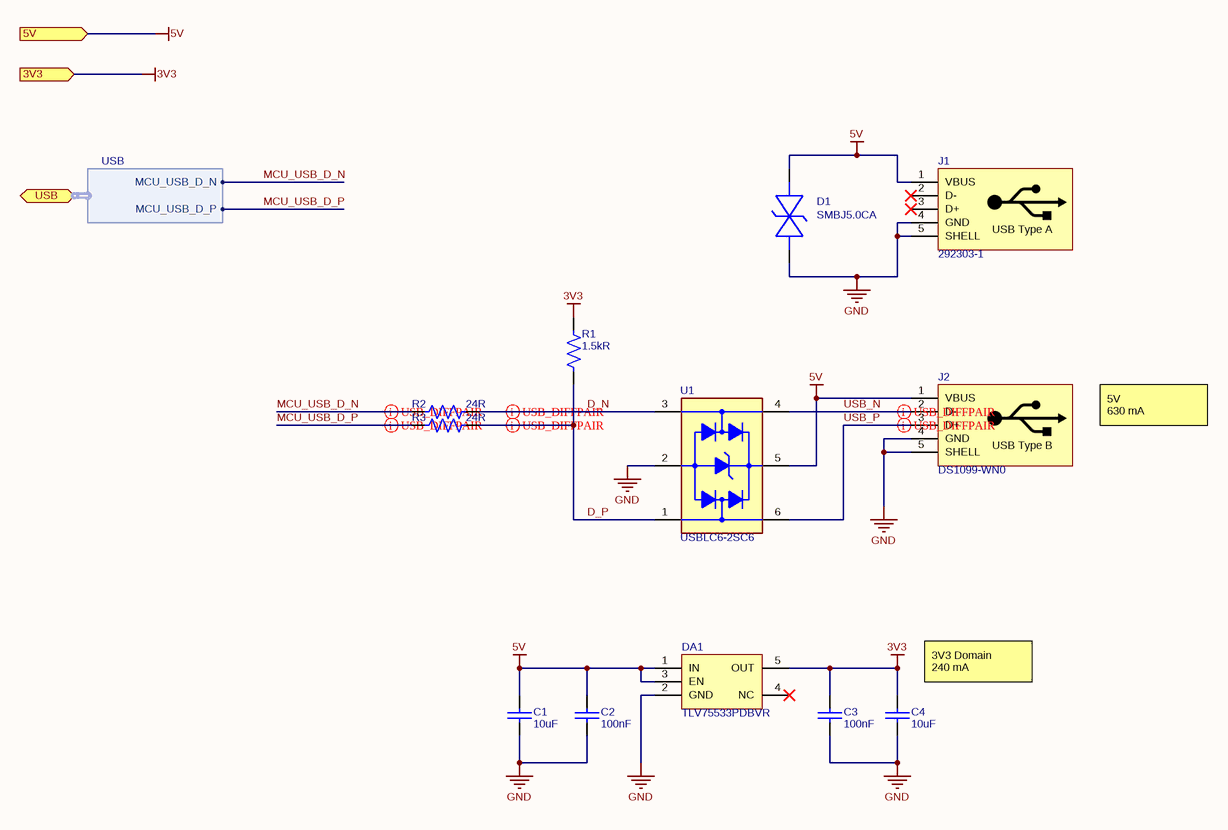
[diagram p3: Gastroscopy-Controller_USB.SchDoc]

### Parts
C1  10uF  [CAP_0805]
C2  100nF  [CAP_0603]
C3  100nF  [CAP_0603]
C4  10uF  [CAP_0805]
D1  SMBJ5.0CA  [SMB-BIDIR]
DA1  TLV75533PDBVR  [SOT-23-5]
J1  292303-1  [292303-1]
J2  DS1099-WN0  [DS1099-WN0]
R1  1.5kR  [RES_0603]
R2  24R  [RES_0603]
R3  24R  [RES_0603]
U1  USBLC6-2SC6  [SOT-23-6]

### Ports
3V3 (in), 5V (in), USB (bidir, harness USB)

### Harnesses
USB: MCU_USB_D_N, MCU_USB_D_P

### Nets
3V3: C3.1 C4.2 DA1.5(OUT) R1.1 ; port 3V3
5V: C1.2 C2.1 D1.1 DA1.1(IN) DA1.3(EN) J1.1(VBUS) J2.1(VBUS) U1.5(VBUS) ; port 5V
GND: C1.1 C2.2 C3.2 C4.1 D1.2 DA1.2(GND) J1.4(GND) J1.5(SHELL) J2.4(GND) J2.5(SHELL) U1.2(GND)
D_N: R2.2 U1.3(I/O_2)
D_P: R1.2 R3.2 U1.1(I/O_1)
MCU_USB_D_N: R2.1 ; port USB.MCU_USB_D_N
MCU_USB_D_P: R3.1 ; port USB.MCU_USB_D_P
USB_N: J2.2(D-) U1.4(I/O_3)
USB_P: J2.3(D+) U1.6(I/O_4)

Not connected (* = marked no-connect by the designer): DA1 4(NC)*; J1 2(D-)* 3(D+)*

### Layout directives
differential pair; differential pair class USB_DIFFPAIR: D_N, D_P, MCU_USB_D_N, MCU_USB_D_P, USB_N, USB_P

### Notes on the sheet
- 5V
  630 mA
- (near C4) 3V3 Domain
  240 mA
- Title:
- Date:
- Size A
- Project:
- Number:
- Time:
- Sheet
- Revision
- of
- Engineer:
- www.mrobots.ru <http://mrobots.ru/>
- File:
- (in symbol 292303-1) USB Type A
- (in symbol DS1099-WN0) USB Type B

### Library data of the parts
C1 C4 = CL21B106KOQNNNE: as C8 on sheet Gastroscopy-Controller_MCU; Supplier 1: Avnet; Manufacturer Part Number 1: CL21B106KOQNNNE; RoHS: Yes; Category: Ceramic Capacitors; Stock 1: 1089000; Pricing 1: 2000=0,02892, 4000=0,02851, 8000=0,02768, 12000=0,02707, 16000=0,02603 (USD); Mount: Surface Mount; Case/Package: 0805; Case Code (Metric): 2012; Case Code (Imperial): 0805; Contact Plating: Tin; Min Operating Temperature: -55°C; Max Operating Temperature: 125°C; Packaging: Tape and Reel; Capacitance: 10uF; Voltage Rating: 16V; Package Quantity: 1; Dielectric: X7R; Series: CL; Construction: Flat; Voltage: 16V; Length: 2mm; Width: 0.049inch; Height: 1.25mm; Thickness: 0.055inch; Depth: 1.25mm; Radiation Hardening: No; RoHS Compliant: Yes; ComponentLink1URL: https://datasheet.ciiva.com/25794/cl21b106koqnnne-25794472.pdf?src-supplier=Digi-Key; ComponentLink1Description: https://datasheet.ciiva.com/25794/cl21b106koqnnne-25794472.pdf?src-supplier=Digi-Key; ComponentLink2URL: https://datasheet.ciiva.com/16428/cl21b106koqnnne-16428887.pdf?src-supplier=Future+Electronics; ComponentLink2Description: https://datasheet.ciiva.com/16428/cl21b106koqnnne-16428887.pdf?src-supplier=Future+Electronics; ComponentLink3URL: https://datasheet.ciiva.com/26920/getdatasheetpartid-355170-26920201.pdf?src-supplier=Verical; ComponentLink3Description: https://datasheet.ciiva.com/26920/getdatasheetpartid-355170-26920201.pdf?src-supplier=Verical; Supplier Part Number 1: CL21B106KOQNNNE
C2 C3 = CL10B104KB8NNNL: as C6 on sheet Gastroscopy-Controller_MCU; Supplier 1: Digi-Key; Manufacturer Part Number 1: CL10B104KB8NNNL; RoHS: Yes; Category: Ceramic Capacitors; Stock 1: 2348404; Pricing 1: 15000=0,00532, 30000=0,00506 (USD); Mount: Surface Mount; Case/Package: 0603; Min Operating Temperature: -55°C; Max Operating Temperature: 125°C; Capacitance: 100nF; Packaging: Tape and Reel; Package Quantity: 15000; Voltage Rating: 50V; Dielectric: X7R; Voltage Rating (DC): 50V; Series: CL; Construction: Flat; Length: 1.6mm; Width: 0.031inch; Height: 0.8mm; Thickness: 0.035inch; Depth: 0.8mm; Radiation Hardening: No; RoHS Compliant: Yes; ComponentLink1URL: https://datasheet.ciiva.com/26838/getdatasheetpartid-357523-26838415.pdf?src-supplier=Verical; ComponentLink1Description: https://datasheet.ciiva.com/26838/getdatasheetpartid-357523-26838415.pdf?src-supplier=Verical; ComponentLink2URL: https://datasheet.ciiva.com/25741/cl10b104kb8nnnl-25741341.pdf?src-supplier=Digi-Key; ComponentLink2Description: https://datasheet.ciiva.com/25741/cl10b104kb8nnnl-25741341.pdf?src-supplier=Digi-Key; Supplier Part Number 1: 1276-CL10B104KB8NNNLTR-ND
D1 = SMBJ5.0CA: TVS DIODE 5VWM 9.2VC SMB; Manufacturer 1: Bourns; Direction: Bidirectional; Max Surge Current: 100A; Reverse Breakdown Voltage: 6.4V; Reverse Standoff Voltage: 5V; Clamping Voltage: 9.2V; Peak Pulse Power: 600W; Breakdown Voltage: 7.25V; Max Reverse Leakage Current: 1.6mA; Test Current: 10mA; Number of Elements: 1; Peak Pulse Current: 65.2A; Element Configuration: Single; Diode Type: ZENER; Operating Supply Voltage: 3.5V; Power Line Protection: No; Supplier 1: Arrow Electronics; RoHS: Yes; Category: TVS Diodes; Stock 1: 3000; Pricing 1: 3000=0,10850, 6000=0,10460, 15000=0,10360, 30000=0,10260 (USD); Mount: Surface Mount; Case/Package: DO-214AA; Number of Pins: 2; Min Operating Temperature: -55°C; Max Operating Temperature: 150°C; Packaging: Tape and Reel; Package Quantity: 1; Min Breakdown Voltage: 6.4V; Polarity: Bidirectional; Termination: SMD/SMT; Max Breakdown Voltage: 7.25V; Leakage Current: 1.6mA; Series: SMBJ; Number of Bidirectional Channels: 1; Number of Channels: 1; Max Power Dissipation: 600W; Resistor Type: Zener; Radiation Hardening: No; RoHS Compliant: Yes; REACH SVHC: No SVHC; ComponentLink1URL: https://datasheet.ciiva.com/334/smbj-334706.pdf?src-supplier=Digi-Key; ComponentLink1Description: https://datasheet.ciiva.com/334/smbj-334706.pdf?src-supplier=Digi-Key; ComponentLink2URL: https://datasheet.ciiva.com/3022/smbj-3022578.pdf?src-supplier=Avnet; ComponentLink2Description: https://datasheet.ciiva.com/3022/smbj-3022578.pdf?src-supplier=Avnet; ComponentLink3URL: https://datasheet.ciiva.com/334/smbj-334707.pdf?src-supplier=Digi-Key; ComponentLink3Description: https://datasheet.ciiva.com/334/smbj-334707.pdf?src-supplier=Digi-Key; ComponentLink4URL: https://datasheet.ciiva.com/334/smbj-334708.pdf?src-supplier=Digi-Key; ComponentLink4Description: https://datasheet.ciiva.com/334/smbj-334708.pdf?src-supplier=Digi-Key; ComponentLink5URL: https://datasheet.ciiva.com/28410/1677318-28410120.pdf?src-supplier=Element14; ComponentLink5Description: https://datasheet.ciiva.com/28410/1677318-28410120.pdf?src-supplier=Element14; ComponentLink6URL: https://datasheet.ciiva.com/8031/1677318-8031161.pdf?src-supplier=Element14; ComponentLink6Description: https://datasheet.ciiva.com/8031/1677318-8031161.pdf?src-supplier=Element14; ComponentLink7URL: https://datasheet.ciiva.com/30104/smbj-30104446.pdf?src-supplier=Onlinecomponents.com; ComponentLink7Description: https://datasheet.ciiva.com/30104/smbj-30104446.pdf?src-supplier=Onlinecomponents.com; Supplier Part Number 1: SMBJ5.0CA; Manufacturer Part Number 1: SMBJ5.0CA
DA1 = TLV75533PDBVR: IC REG LINEAR 3.3V 500MA SOT23-5; Manufacturer 1: Texas Instruments; Output Type: Fixed; Output Configuration: Positive; Number of Regulators: 1; Max Input Voltage: 5.5V; Dropout Voltage: 238mV; Quiescent Current: 31uA; Power Supply Rejection Ratio (PSRR): 52dB; Supplier 1: Mouser; RoHS: Yes; Category: Voltage Regulators - Linear; Stock 1: 90; Pricing 1: 1=0,46000, 10=0,39400, 50=0,39400, 100=0,27300, 1000=0,17900, 10000=0,16200 (USD); Mount: Surface Mount; Case/Package: SOT-23-5; Min Operating Temperature: -40°C; Max Operating Temperature: 125°C; Packaging: Cut Tape; Min Output Voltage: 3.3V; Max Output Voltage: 3.3V; Output Current: 500mA; RoHS Compliant: Yes; ComponentLink1URL: http://www.ti.com/lit/ds/symlink/tlv755p.pdf?src-supplier=Digi-Key; ComponentLink1Description: http://www.ti.com/lit/ds/symlink/tlv755p.pdf?src-supplier=Digi-Key; ComponentLink2URL: http://www.ti.com/general/docs/suppproductinfo.tsp?distId=10&amp;gotoUrl=http%3A%2F%2Fwww.ti.com%2Flit%2Fgpn%2Ftlv755p&src-supplier=Digi-Key; ComponentLink2Description: http://www.ti.com/general/docs/suppproductinfo.tsp?distId=10&amp;gotoUrl=http%3A%2F%2Fwww.ti.com%2Flit%2Fgpn%2Ftlv755p&src-supplier=Digi-Key; Supplier Part Number 1: 595-TLV75533PDBVR; Manufacturer Part Number 1: TLV75533PDBVR
J1 = 292303-1: CONN RCPT USB2.0 TYPEA 4POS R/A; Manufacturer 1: TE Connectivity; Description: Conn USB 2.0 Type A RCP 4 POS 2mm/2.5mm Solder RA Thru-Hole 4 Terminal 1 Port Box/Tube; Number of Terminals/Pins: 4; Plating: Bright,Tin; Gender: Receptacle; Number of Ports: 1; Contact Current Rating: 1A; Circuit Application: Signal; Connector System: Cable-to-Board; Shielding: Shielded; Insulation Resistance: 1GR; Voltage Rating (AC): 30V; Mode: Singlemode; Plating Thickness: 0.76um; PCB Thickness: 0.062inch; Pitch: 2.5mm; Tail Length: 0.112inch; Approvals: UL; Supplier 1: RSComponents; Manufacturer Part Number 1: 292303-1; RoHS: Yes; Category: Audio / Video Connectors; Stock 1: 2945; Pricing 1: 125=1,33200, 375=1,19600, 1000=1,13200, 2000=1,08000 (GBP); Mount: Through Hole,Horizontal; Contact Plating: Gold; Contact Material: Copper Alloy,Copper; Color: Black; Housing Material: Thermoplastic; Housing Color: Black; Insulation Color: Black; Min Operating Temperature: -67°C; Max Operating Temperature: 185°C; Packaging: Rail/Tube; Package Quantity: 30; Connector Type: Receptacle; Termination: Through Hole; Number of Contacts: 4; Number of Positions: 4; Orientation: Right Angle; USB Standard: USB 2.0; Series: -; Current Rating: 1A; Length: 14.63mm; Depth: 14mm; Reach SVHC Compliant: Yes; Flammability Rating: UL94 V-0; RoHS Compliant: Yes; Halogen Free: Halogen Free; Supplier Part Number 1: 5298195P
J2 = DS1099-WN0: CONN TYPE B SKT HORIZONTAL TH; Manufacturer 1: Ningbo Connfly Electric; Manufacturer Part Number 1: DS1099-WN0
R1 = RC0603FR-071K5L: RES 1.5K OHM 1% 1/10W 0603; Manufacturer 1: Yageo; Voltage Rating (DC): 50V; Temperature Coefficient: 100ppm/°C; Power Rating: 100mW; Supplier 1: Arrow Electronics; RoHS: Yes; Category: Chip SMD Resistors; Stock 1: 15000; Pricing 1: 5000=0,00350 (USD); Case/Package: 0603; Number of Pins: 2; Case Code (Metric): 1608; Case Code (Imperial): 0603; Size Code: 0603; Min Operating Temperature: -55°C; Max Operating Temperature: 155°C; Tolerance: 1%; Packaging: Tape and Reel; Resistance: 1.5kR; Resistor Type: Thick Film; Voltage Rating: 50V; Package Quantity: 1; Number of Terminations: 2; Termination: SMD/SMT; Max Power Dissipation: 100mW; Features: Moisture Resistant; Series: RC; Resistance Tolerance: 1%; Construction: Rectangular; Length: 0.063inch; Width: 0.031inch; Height: 0.022inch; Depth: 0.8mm; REACH SVHC: No SVHC; Lead Free: Lead Free; Military Standard: Not; RoHS Compliant: Yes; ComponentLink1URL: https://datasheet.ciiva.com/46440/1868787-46440895.pdf?src-supplier=Element14; ComponentLink1Description: https://datasheet.ciiva.com/46440/1868787-46440895.pdf?src-supplier=Element14; ComponentLink2URL: https://datasheet.ciiva.com/2454/pyu-r-int-thick-7-2454514.pdf?src-supplier=Digi-Key; ComponentLink2Description: https://datasheet.ciiva.com/2454/pyu-r-int-thick-7-2454514.pdf?src-supplier=Digi-Key; ComponentLink3URL: https://datasheet.ciiva.com/2454/pyu-r-int-thick-7-2454515.pdf?src-supplier=Digi-Key; ComponentLink3Description: https://datasheet.ciiva.com/2454/pyu-r-int-thick-7-2454515.pdf?src-supplier=Digi-Key; ComponentLink4URL: https://datasheet.ciiva.com/2454/pyu-r-int-thick-7-2454513.pdf?src-supplier=Digi-Key; ComponentLink4Description: https://datasheet.ciiva.com/2454/pyu-r-int-thick-7-2454513.pdf?src-supplier=Digi-Key; Supplier Part Number 1: RC0603FR-071K5L; Manufacturer Part Number 1: RC0603FR-071K5L
R2 R3 = RC0603FR-0724RL: RES 24 OHM 1% 1/10W 0603; Manufacturer 1: Yageo; Power Rating: 100mW; Voltage Rating (DC): 50V; Temperature Coefficient: 100ppm/°C; Working Voltage: 75V; Supplier 1: Arrow Electronics; RoHS: Yes; Category: Chip SMD Resistors; Stock 1: 90000; Pricing 1: 5000=0,00190, 125000=0,00160 (USD); Case/Package: 0603; Case Code (Imperial): 0603; Case Code (Metric): 1608; Min Operating Temperature: -55°C; Max Operating Temperature: 155°C; Tolerance: 1%; Resistance: 24R; Packaging: Tape and Reel; Voltage Rating: 50V; Termination: SMD/SMT; Number of Terminations: 2; Features: Moisture Resistant; Series: RC; Max Power Dissipation: 100mW; Lead Free: Lead Free; RoHS Compliant: Yes; Supplier Part Number 1: RC0603FR-0724RL; Manufacturer Part Number 1: RC0603FR-0724RL
U1 = USBLC6-2SC6: TVS DIODE 5.25VWM 17VC SOT23-6; Manufacturer 1: STMicroelectronics; Direction: Unidirectional,Bidirectional; Capacitance: 3.5pF; Operating Supply Voltage: 1.1V; Number of Channels: 2; Breakdown Voltage: 6V; Clamping Voltage: 17V; Reverse Standoff Voltage: 5.25V; Power Line Protection: Yes; Test Current: 1mA; Max Reverse Leakage Current: 150nA; Peak Pulse Current: 5A; Element Configuration: Dual; Data Rate: 480Mbps; Number of Elements: 1; Working Voltage: 5V; Supplier 1: Digi-Key; RoHS: Yes; Category: TVS Diodes; Pricing 1: 1=0.63000, 10=0.54200, 100=0.40440, 500=0.31774, 1000=0.24553 (USD); Mount: Surface Mount; Case/Package: SOT-23; Number of Pins: 6; Contact Plating: Tin,Matte; Min Operating Temperature: -40°C; Max Operating Temperature: 125°C; Packaging: Tape and Reel; Package Quantity: 3000; Termination: SMD/SMT; Number of Bidirectional Channels: 2; Min Breakdown Voltage: 6V; ESD Protection: Yes; Leakage Current: 150nA; Series: USB; Reverse Breakdown Voltage: 6V; Polarity: Unidirectional,Bidirectional; Max Breakdown Voltage: 6V; Clamping Voltage-Max: 17V; Length: 3.05mm; Width: 1.75mm; Height: 1.3mm; Depth: 1.75mm; Radiation Hardening: No; REACH SVHC: No SVHC; Lead Free: Lead Free; RoHS Compliant: Yes; ComponentLink1URL: https://datasheet.ciiva.com/1268/1690354-1268384.pdf?src-supplier=Element14; ComponentLink1Description: https://datasheet.ciiva.com/1268/1690354-1268384.pdf?src-supplier=Element14; ComponentLink2URL: https://datasheet.ciiva.com/4508/cd00050750-113117-4508433.pdf?src-supplier=Mouser; ComponentLink2Description: https://datasheet.ciiva.com/4508/cd00050750-113117-4508433.pdf?src-supplier=Mouser; ComponentLink3URL: https://datasheet.ciiva.com/15143/getdatasheetpartid-148465-15143789.pdf?src-supplier=Verical; ComponentLink3Description: https://datasheet.ciiva.com/15143/getdatasheetpartid-148465-15143789.pdf?src-supplier=Verical; ComponentLink4URL: https://datasheet.ciiva.com/16200/cd00050750-16200026.pdf?src-supplier=Future+Electronics; ComponentLink4Description: https://datasheet.ciiva.com/16200/cd00050750-16200026.pdf?src-supplier=Future+Electronics; ComponentLink5URL: https://datasheet.ciiva.com/41444/001184109-da-01-en-ic-esd-protecti-usblc6-2sc6-sot-23-6-stm-41444156.pdf?src-supplier=Conrad; ComponentLink5Description: https://datasheet.ciiva.com/41444/001184109-da-01-en-ic-esd-protecti-usblc6-2sc6-sot-23-6-stm-41444156.pdf?src-supplier=Conrad; Supplier Part Number 1: 497-5235-6-ND; Manufacturer Part Number 1: USBLC6-2SC6